# EAGLE design bias_v1 (EAGLE 9.6.2)
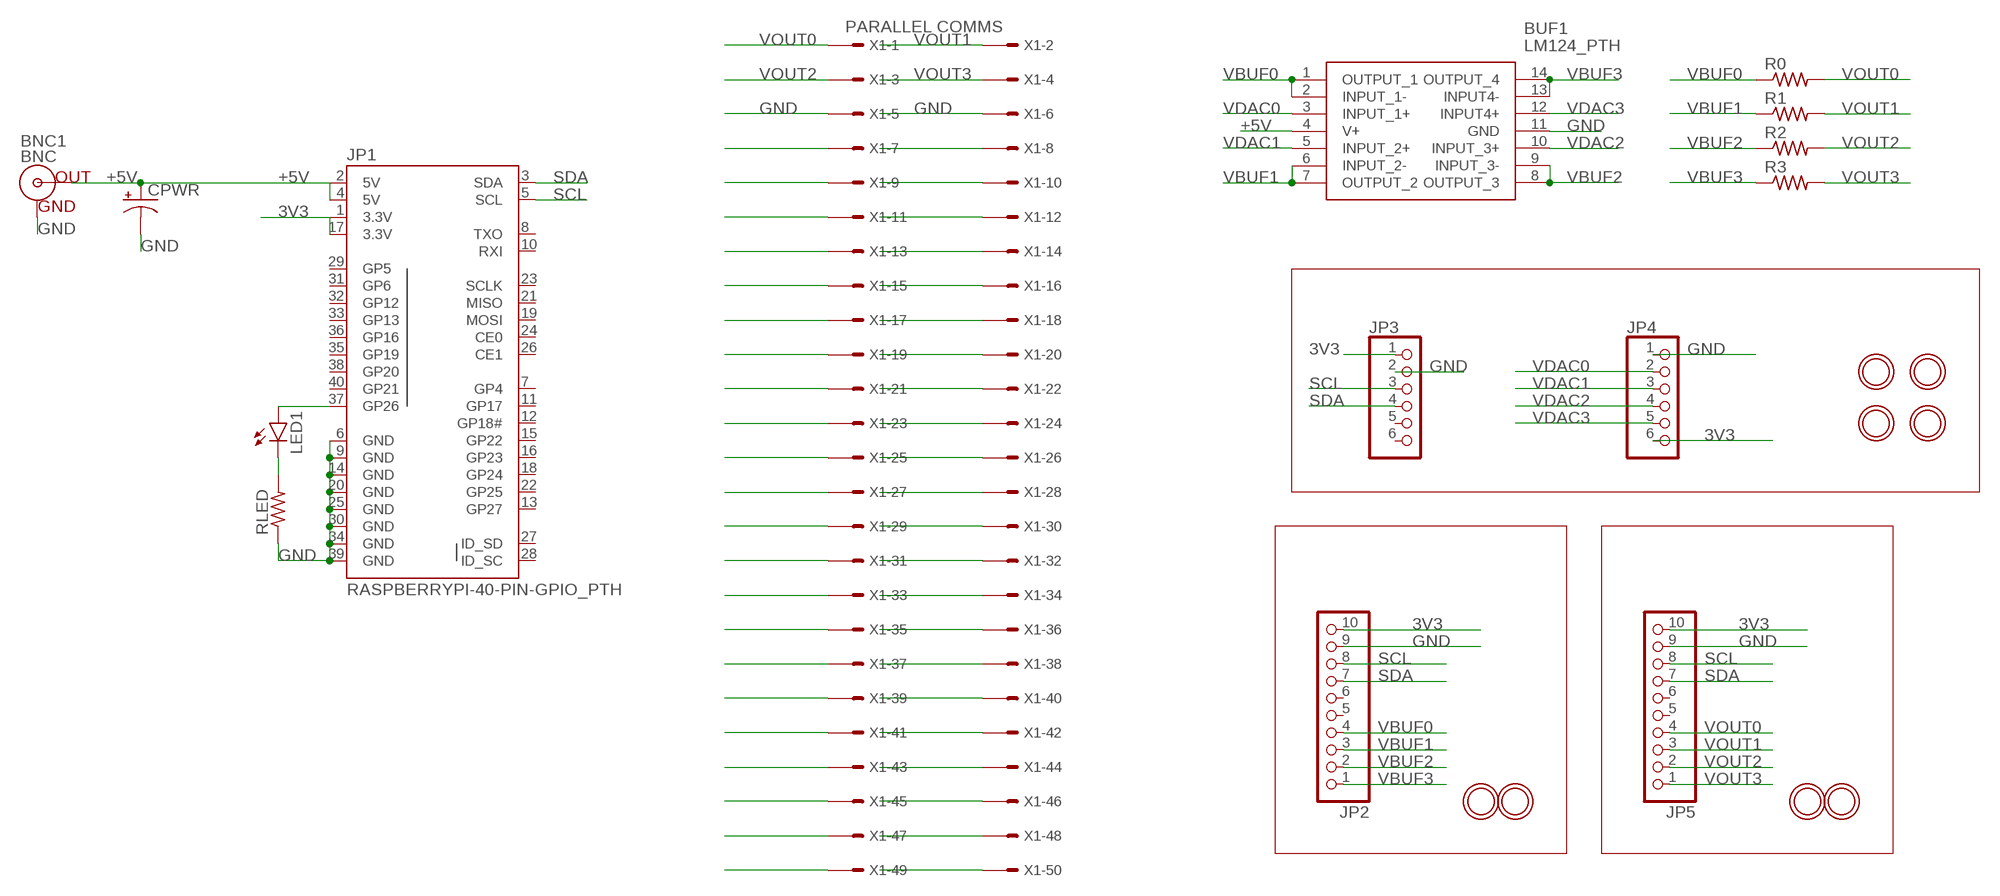
[diagram p0: schematic, sheet 1]

## Parts
BNC1  BNC  BNCPTH  [BNC]
BUF1  LM124_PTH  [CDIP790W66P254L1954H508Q14]
CPWR  CPOL-USE2.5-6  [E2,5-6]
JP1  RASPBERRYPI-40-PIN-GPIO_PTH  [2X20_SHROUDED]
JP2  HEADER-1X1070MIL  [1X10_ROUND70]
JP3  HEADER-1X670MIL  [1X06_ROUND_70]
JP4  HEADER-1X670MIL  [1X06_ROUND_70]
JP5  HEADER-1X1070MIL  [1X10_ROUND70]
LED1  LED3MM  [LED3MM]
R0  R-US_0204/7  [0204/7]
R1  R-US_0204/7  [0204/7]
R2  R-US_0204/7  [0204/7]
R3  R-US_0204/7  [0204/7]
RLED  R-US_0204/7  [0204/7]
U$3  MOUNTINGHOLE2.5  [MOUNTINGHOLE_2.5_PLATED]
U$4  MOUNTINGHOLE2.5  [MOUNTINGHOLE_2.5_PLATED]
U$5  MOUNTINGHOLE2.5  [MOUNTINGHOLE_2.5_PLATED]
U$6  MOUNTINGHOLE2.5  [MOUNTINGHOLE_2.5_PLATED]
U$7  MOUNTINGHOLE2.5  [MOUNTINGHOLE_2.5_PLATED]
U$8  MOUNTINGHOLE2.5  [MOUNTINGHOLE_2.5_PLATED]
U$15  MOUNTINGHOLE2.5  [MOUNTINGHOLE_2.5_PLATED]
U$16  MOUNTINGHOLE2.5  [MOUNTINGHOLE_2.5_PLATED]
X1  PARALLEL COMMS  057-050-1  [057-050-1]

## Nets
3V3: JP1.1(3.3V) JP1.17(3.3V) JP2.10 JP3.1 JP4.6 JP5.10
+5V: BNC1.S(OUT) BUF1.4(V+) CPWR.+ JP1.2(5V) JP1.4(5V)
GND: BNC1.GND BUF1.11(GND) CPWR.- JP1.6(GND) JP1.9(GND) JP1.14(GND) JP1.20(GND) JP1.25(GND) JP1.30(GND) JP1.34(GND) JP1.39(GND) JP2.9 JP3.2 JP4.1 JP5.9 RLED.1 X1.5 X1.6
N$1: JP1.37(GP26) LED1.A
N$2: LED1.K(C) RLED.2
N$4: X1.7
N$5: X1.9
N$6: X1.11
N$7: X1.13
N$8: X1.15
N$9: X1.17
N$10: X1.19
N$11: X1.21
N$12: X1.23
N$13: X1.25
N$14: X1.27
N$15: X1.29
N$16: X1.31
N$17: X1.33
N$18: X1.35
N$19: X1.37
N$20: X1.39
N$21: X1.41
N$22: X1.43
N$23: X1.45
N$24: X1.47
N$25: X1.49
N$26: X1.42
N$27: X1.44
N$28: X1.46
N$29: X1.48
N$30: X1.50
N$31: X1.32
N$32: X1.34
N$33: X1.36
N$34: X1.38
N$35: X1.40
N$36: X1.22
N$37: X1.24
N$38: X1.26
N$39: X1.28
N$40: X1.30
N$41: X1.12
N$42: X1.14
N$43: X1.16
N$44: X1.18
N$45: X1.20
N$49: X1.8
N$50: X1.10
SCL: JP1.5(SCL) JP2.8 JP3.3 JP5.8
SDA: JP1.3(SDA) JP2.7 JP3.4 JP5.7
VBUF0: BUF1.1(OUTPUT_1) BUF1.2(INPUT_1-) JP2.4 R0.1
VBUF1: BUF1.6(INPUT_2-) BUF1.7(OUTPUT_2) JP2.3 R1.1
VBUF2: BUF1.8(OUTPUT_3) BUF1.9(INPUT_3-) JP2.2 R2.1
VBUF3: BUF1.13(INPUT4-) BUF1.14(OUTPUT_4) JP2.1 R3.1
VDAC0: BUF1.3(INPUT_1+) JP4.2
VDAC1: BUF1.5(INPUT_2+) JP4.3
VDAC2: BUF1.10(INPUT_3+) JP4.4
VDAC3: BUF1.12(INPUT4+) JP4.5
VOUT0: JP5.4 R0.2 X1.1
VOUT1: JP5.3 R1.2 X1.2
VOUT2: JP5.2 R2.2 X1.3
VOUT3: JP5.1 R3.2 X1.4
Unconnected: JP1.7(GP4) JP1.8(TXO) JP1.10(RXI) JP1.11(GP17) JP1.12(GP18#) JP1.13(GP27) JP1.15(GP22) JP1.16(GP23) JP1.18(GP24) JP1.19(MOSI) JP1.21(MISO) JP1.22(GP25) JP1.23(SCLK) JP1.24(CE0) JP1.26(CE1) JP1.27(ID_SD) JP1.28(ID_SC) JP1.29(GP5) JP1.31(GP6) JP1.32(GP12) JP1.33(GP13) JP1.35(GP19) JP1.36(GP16) JP1.38(GP20) JP1.40(GP21) JP2.5 JP2.6 JP3.5 JP3.6 JP5.5 JP5.6

## Library data of the parts
BNC1 = SparkFun-Connectors:BNC: BNC Right Angle Connector Mouser Part# 5227161 SparkFun Products: BNC Connector - Right Angle <https://www.sparkfun.com/products/10550>; PROD_ID: LPA-12729; SF_ID: PRT-10550
BUF1 = SamacSys_Parts:LM124_PTH: Low Power Quad Operational Amplifier Source: Datasheet <http://www.ti.com/lit/gpn/lm124-n>; ARROW_PART_NUMBER: LM124J/PB; ARROW_PRICE-STOCK: https://www.arrow.com/en/products/lm124jpb/texas-instruments; DESCRIPTION: Low Power Quad Operational Amplifier; HEIGHT: 5.08mm; MANUFACTURER_NAME: Texas Instruments; MANUFACTURER_PART_NUMBER: LM124J/PB; MOUSER_PART_NUMBER: 926-LM124J; MOUSER_PRICE-STOCK: https://www.mouser.co.uk/ProductDetail/Texas-Instruments/LM124J-PB?qs=iiglMaU8SAcLiddS7jKHDA%3D%3D
CPWR = rcl:CPOL-US: POLARIZED CAPACITOR, American symbol; SPICEPREFIX: C
JP1 = SparkFun-Connectors:RASPBERRYPI-40-PIN-GPIO: Raspberry Pi GPIO Header 2x20 pin connector, as found on B, B+, A+ models. Both shrouded PTH and SMT versions available. SparkFun Products: GPIO Shrouded Header <https://www.sparkfun.com/products/13054>- PTH SparkFun Pi Wedge (Preassembled) <https://www.sparkfun.com/products/13717>; PROD_ID: CONN-12263; SF_ID: PRT-13054
JP2 JP5 = microbuilder:HEADER-1X10: PIN HEADER
JP3 JP4 = microbuilder:HEADER-1X6: PIN HEADER
LED1 = led:LED: LED OSRAM: - CHIPLED LG R971, LG N971, LY N971, LG Q971, LY Q971, LO R971, LY R971 LH N974, LH R974 LS Q976, LO Q976, LY Q976 LO Q996 - Hyper CHIPLED LW Q18S LB Q993, LB Q99A, LB R99A - SideLED LS A670, LO A670, LY A670, LG A670, LP A670 LB A673, LV A673, LT A673, LW A673 LH A674 LY A675 LS A676, LA A676, LO A676, LY A676, LW A676 LS A679, LY A679, LG A679 - Hyper Micro SIDELED® LS Y876, LA Y876, LO Y876, LY Y876 LT Y87S - SmartLED LW L88C, LW L88S LB L89C, LB L89S, LG L890 LS L89K, LO L89K, LY L89K LS L896, LA L896, LO L896, LY L896 - TOPLED LS T670, LO T670, LY T670, LG T670, LP T670 LSG T670, LSP T670, LSY T670, LOP T670, LYG T670 LG T671, LOG T671, LSG T671 LB T673, LV T673, LT T673, LW T673 LH T674 LS T676, LA T676, LO T676, LY T676, LB T676, LH T676, LSB T676, LW T676 LB T67C, LV T67C, LT T67C, LS T67K, LO T67K, LY T67K, LW E67C LS E67B, LA E67B, LO E67B, LY E67B, LB E67C, LV E67C, LT E67C LW T67C LS T679, LY T679, LG T679 LS T770, LO T770, LY T770, LG T770, LP T770 LB T773, LV T773, LT T773, LW T773 LH T774 LS E675, LA E675, LY E675, LS T675 LS T776, LA T776, LO T776, LY T776, LB T776 LHGB T686 LT T68C, LB T68C - Hyper Mini TOPLED® LB M676 - Mini TOPLED Santana® LG M470 LS M47K, LO M47K, LY M47K Source: http://www.osram.convergy.de LUXEON: - LUMILED® LXK2-PW12-R00, LXK2-PW12-S00, LXK2-PW14-U00, LXK2-PW14-V00 LXK2-PM12-R00, LXK2-PM12-S00, LXK2-PM14-U00 LXK2-PE12-Q00, LXK2-PE12-R00, LXK2-PE12-S00, LXK2-PE14-T00, LXK2-PE14-U00 LXK2-PB12-K00, LXK2-PB12-L00, LXK2-PB12-M00, LXK2-PB14-N00, LXK2-PB14-P00, LXK2-PB14-Q00 LXK2-PR12-L00, LXK2-PR12-M00, LXK2-PR14-Q00, LXK2-PR14-R00 LXK2-PD12-Q00, LXK2-PD12-R00, LXK2-PD12-S00 LXK2-PH12-R00, LXK2-PH12-S00 LXK2-PL12-P00, LXK2-PL12-Q00, LXK2-PL12-R00 Source: www.luxeon.com KINGBRIGHT: KA-3528ASYC Source: www.kingbright.com
R0 R1-R3 RLED = rcl:R-US_: RESISTOR, American symbol; SPICEPREFIX: R
U$3-U$8 U$15 U$16 = microbuilder:MOUNTINGHOLE: Mounting Hole For #2 screws (0.086"/2.18mm width, 0.094"/2.4mm hole) use 2.5mm
X1 = con-panduit:057-050-: CONNECTOR 50-pin series 057 contact pc board low profile headers; OC_FARNELL: unknown; OC_NEWARK: unknown

## Net classes
2 lowpower: width 0.305 mm, drill 0.483 mm

## Board
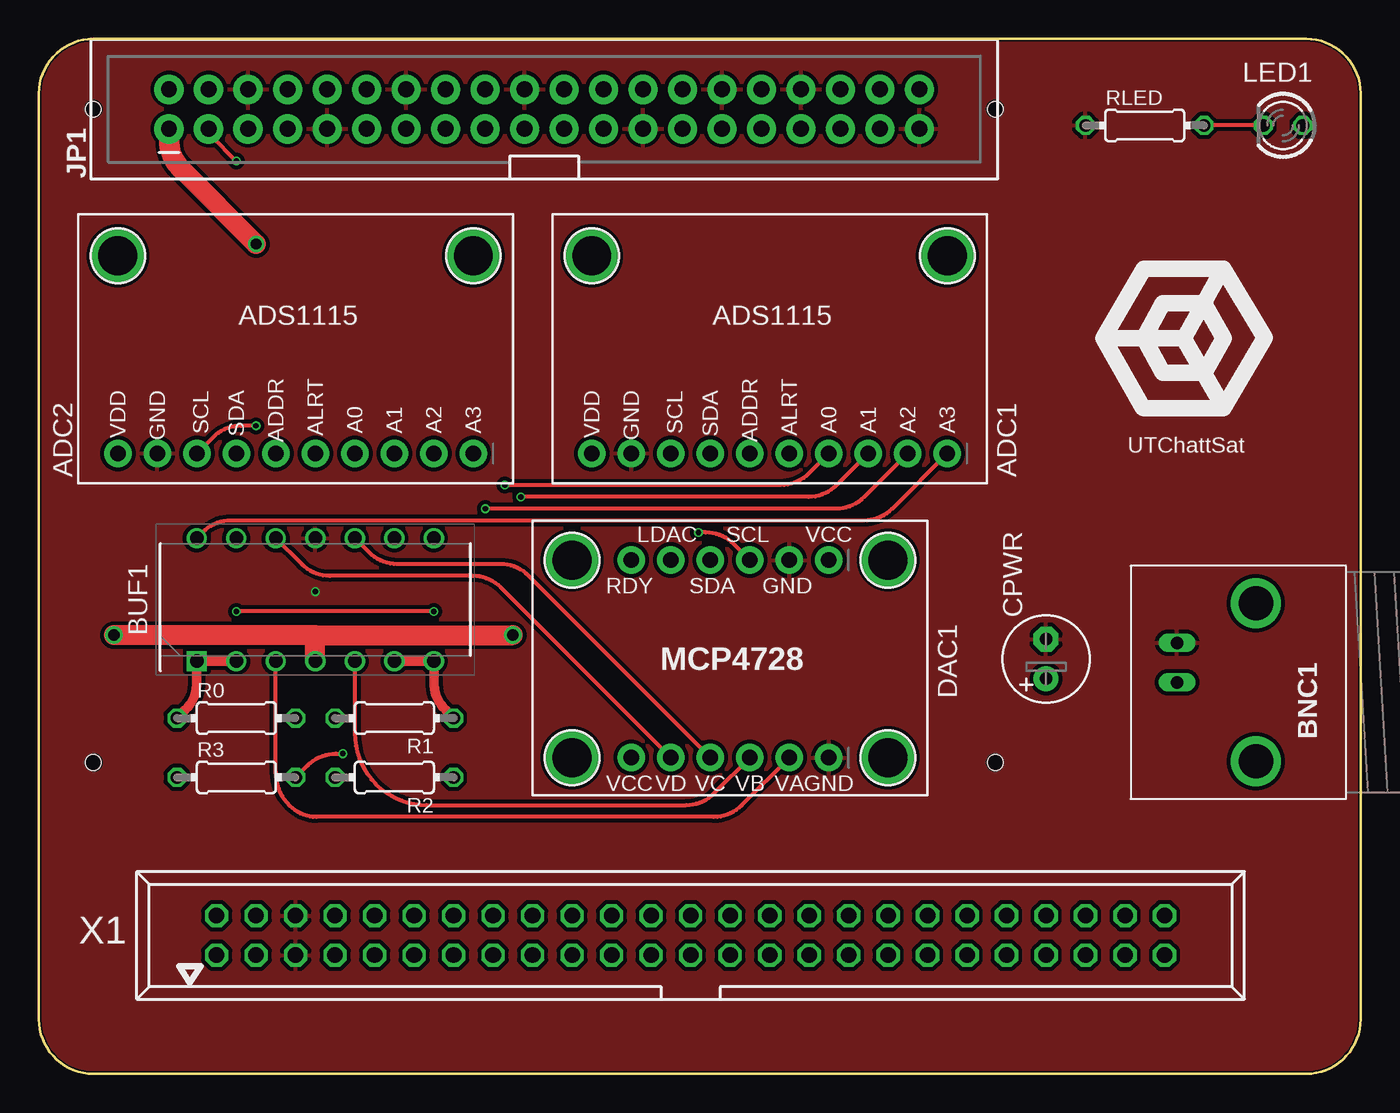
[diagram p1: board, top side]
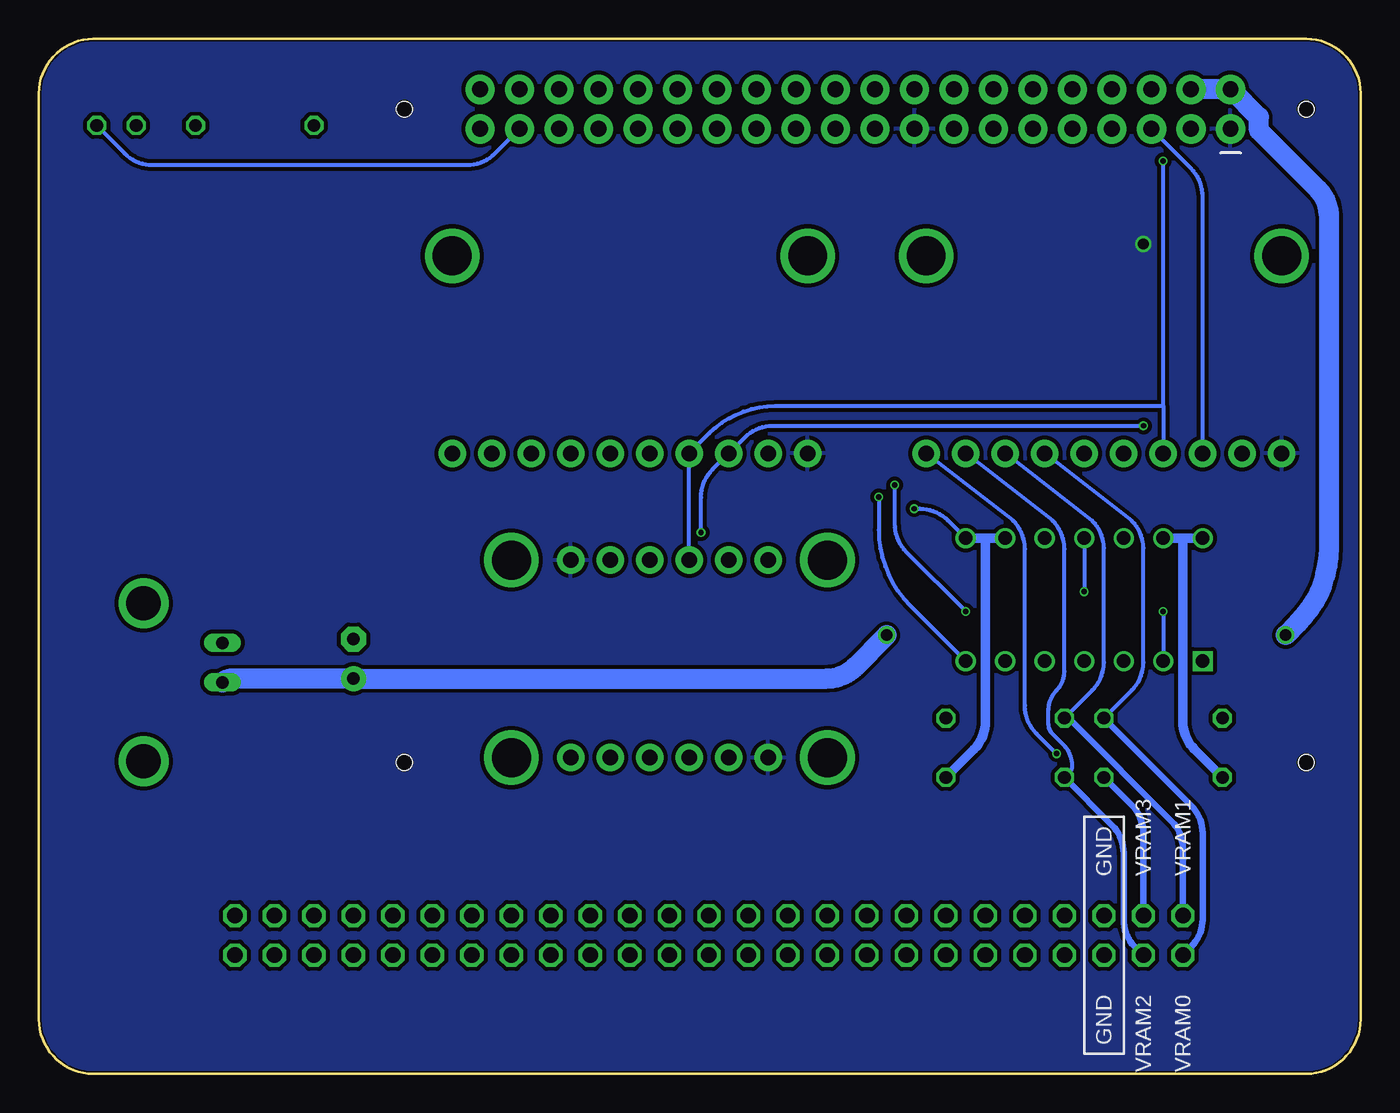
[diagram p2: board, bottom side, seen from below]

Size 85 x 66.53 mm. Coordinates in mm from the lower left corner, seen from the top.
Outline: 3.5,0 81.5,0 arc90 85,3.5 85,63.03 arc90 81.5,66.53 3.5,66.53 arc90 0,63.03 0,3.5 arc90 3.5,0
Copper layers (1*16): Top 0.035mm / dielectric 0.2mm / Bottom 0.035mm
Design rules "jlcpcb-2-layer *": minimum track width 10mil, minimum drill 0.2mm, track to track 10mil, track to pad 10mil, pad to pad 5mil, via to via 5mil, smd to smd 0mil, copper to edge 0.1mm, drill to drill 5mil, minimum pad ring 4mil, minimum via ring 4mil, stop-mask expansion 3mil, vias tented up to drill 100mil, thermal gap 10mil
Holes 1 mm at 3.5,62.01 61.5,62.01 61.5,20.01 3.5,20.01

### Footprints (pad centres in the part's own frame; a part is rotated, then mirrored left to right if it is on the bottom)
BNC = drill 2.2: 3 -5.08,5.08; 4 5.08,5.08 | drill 0.8 long: GND -2.54,0; S 0,0
CDIP790W66P254L1954H508Q14 = drill 0.86 pad 1.26 square: 1 -3.95,7.62 | drill 0.86 pad 1.26: 2 -3.95,5.08; 3 -3.95,2.54; 4 -3.95,0; 5 -3.95,-2.54; 6 -3.95,-5.08; 7 -3.95,-7.62; 8 3.95,-7.62; 9 3.95,-5.08; 10 3.95,-2.54; 11 3.95,0; 12 3.95,2.54; 13 3.95,5.08; 14 3.95,7.62
E2,5-6 = drill 0.813 pad 1.6: + -1.27,0 | drill 0.813 pad 1.6 octagon: - 1.27,0
2X20_SHROUDED = drill 1.016 pad 1.88: 1 -1.27,24.13; 2 1.27,24.13; 3 -1.27,21.59; 4 1.27,21.59; 5 -1.27,19.05; 6 1.27,19.05; 7 -1.27,16.51; 8 1.27,16.51; 9 -1.27,13.97; 10 1.27,13.97; 11 -1.27,11.43; 12 1.27,11.43; 13 -1.27,8.89; 14 1.27,8.89; 15 -1.27,6.35; 16 1.27,6.35; 17 -1.27,3.81; 18 1.27,3.81; 19 -1.27,1.27; 20 1.27,1.27; 21 -1.27,-1.27; 22 1.27,-1.27; 23 -1.27,-3.81; 24 1.27,-3.81; 25 -1.27,-6.35; 26 1.27,-6.35; 27 -1.27,-8.89; 28 1.27,-8.89; 29 -1.27,-11.43; 30 1.27,-11.43; 31 -1.27,-13.97; 32 1.27,-13.97; 33 -1.27,-16.51; 34 1.27,-16.51; 35 -1.27,-19.05; 36 1.27,-19.05; 37 -1.27,-21.59; 38 1.27,-21.59; 39 -1.27,-24.13; 40 1.27,-24.13
1X10_ROUND70 = drill 1 pad 1.778: 1 -11.43,0; 2 -8.89,0; 3 -6.35,0; 4 -3.81,0; 5 -1.27,0; 6 1.27,0; 7 3.81,0; 8 6.35,0; 9 8.89,0; 10 11.43,0
1X06_ROUND_70 = drill 1 pad 1.778: 1 -6.35,0; 2 -3.81,0; 3 -1.27,0; 4 1.27,0; 5 3.81,0; 6 6.35,0
LED3MM = drill 0.813 octagon: A -1.27,0; K 1.27,0
0204/7 = drill 0.813 octagon: 1 -3.81,0; 2 3.81,0
MOUNTINGHOLE_2.5_PLATED = drill 2.5 pad 3.2: P$1 0,0
057-050-1 = drill 1 octagon: 1 -30.48,-1.27; 2 -30.48,1.27; 3 -27.94,-1.27; 4 -27.94,1.27; 5 -25.4,-1.27; 6 -25.4,1.27; 7 -22.86,-1.27; 8 -22.86,1.27; 9 -20.32,-1.27; 10 -20.32,1.27; 11 -17.78,-1.27; 12 -17.78,1.27; 13 -15.24,-1.27; 14 -15.24,1.27; 15 -12.7,-1.27; 16 -12.7,1.27; 17 -10.16,-1.27; 18 -10.16,1.27; 19 -7.62,-1.27; 20 -7.62,1.27; 21 -5.08,-1.27; 22 -5.08,1.27; 23 -2.54,-1.27; 24 -2.54,1.27; 25 0,-1.27; 26 0,1.27; 27 2.54,-1.27; 28 2.54,1.27; 29 5.08,-1.27; 30 5.08,1.27; 31 7.62,-1.27; 32 7.62,1.27; 33 10.16,-1.27; 34 10.16,1.27; 35 12.7,-1.27; 36 12.7,1.27; 37 15.24,-1.27; 38 15.24,1.27; 39 17.78,-1.27; 40 17.78,1.27; 41 20.32,-1.27; 42 20.32,1.27; 43 22.86,-1.27; 44 22.86,1.27; 45 25.4,-1.27; 46 25.4,1.27; 47 27.94,-1.27; 48 27.94,1.27; 49 30.48,-1.27; 50 30.48,1.27

### Placement (x,y rotation side)
BNC1  73.19,25.16 270 top
BUF1  17.78,30.48 90 top
CPWR  64.77,26.67 90 top
JP1  32.5,62.01 90 top
JP2  46.99,39.88 180 top
JP3  44.45,33.02 180 top
JP4  44.45,20.32 180 top
JP5  16.51,39.88 180 top
LED1  80.01,60.96 180 top
R0  12.7,22.86 0 top
R1  22.86,22.86 180 top
R2  22.86,19.05 180 top
R3  12.7,19.05 0 top
RLED  71.12,60.96 0 top
U$3  58.42,52.58 180 top
U$4  54.61,20.32 180 top
U$5  34.29,20.32 180 top
U$6  54.61,33.02 180 top
U$7  34.29,33.02 180 top
U$8  35.56,52.58 180 top
U$15  27.94,52.58 180 top
U$16  5.08,52.58 180 top
X1  41.91,8.89 0 top

### Tracks (layer width: path | path; a pad name or v marks a point on that pad's centre or on a via)
3V3  (via drill 0.7)
  Top 1.27: JP1.1 8.37,59.99 arc45 9.11,58.2 v13.97,53.34
  pour Bottom: -0.25,67.06 -0.25,-0.25 85.34,-0.25 85.34,67.06
+5V  (via drill 0.75)
  Top 1.27: BUF1.4 17.78,28.19 | 17.78,28.19 v30.48,28.19 | 17.78,28.19 v4.83,28.19
  Bottom 1.27: BNC1.S arc45 72.61,25.4 CPWR.+ 34.33,25.4 arc-45 32.53,26.14 v30.48,28.19 | v4.83,28.19 4.03,28.99 arc-45 2.03,33.82 2.03,55.12 arc-45 2.75,56.85 6.54,60.64 6.54,61.5 8.32,63.28 JP1.2 JP1.4
GND  (via drill 0.35)
  Bottom 0.254: BUF1.11 v17.78,30.99
  pour Top: -0.25,67.06 85.34,67.06 85.34,66.8 85.34,-0.25 -0.25,-0.25
N$1
  Bottom 0.254: LED1.A 79.48,59.16 arc-45 77.69,58.42 57.46,58.42 arc-45 55.67,59.16 JP1.37
N$2
  Top 0.254: LED1.K RLED.2
SCL  (via drill 0.35)
  Top 0.254: JP3.3 44.69,34.05 arc45 42.89,34.8 v42.42,34.8 | v13.97,41.66 12.99,41.66 arc45 11.19,40.91 JP5.8
  Bottom 0.254: JP5.8 10.16,56.4 arc-45 10.9,58.19 JP1.5 | v13.97,41.66 37.81,41.66 arc-45 39.61,40.91 JP2.8 41.67,38.84 arc-45 42.42,37.05 v42.42,34.8
SDA  (via drill 0.35)
  Top 0.254: v12.7,58.67 11.11,60.27 arc-45 JP1.3
  Bottom 0.254: JP3.4 JP2.7 41.9,41.16 arc45 37.64,42.93 12.7,42.93 | 12.7,42.93 JP5.7 | 12.7,42.93 v12.7,58.67
VBUF0  (via drill 0.35)
  Top 0.254: JP2.4 49.51,38.59 arc-45 47.72,37.85 v29.97,37.85 | v25.4,29.72 v12.7,29.72
  Top 0.61: BUF1.2 BUF1.1 10.16,25.18 arc-45 9.42,23.39 R0.1
  Bottom 0.254: v29.97,37.85 29.97,35.34 arc-45 29.23,33.55 v25.4,29.72 | v12.7,29.72 BUF1.2
VBUF1  (via drill 0.35)
  Top 0.254: JP2.3 51.29,37.83 arc-45 49.49,37.08 v30.99,37.08
  Top 0.61: BUF1.6 BUF1.7 25.4,25.18 arc45 26.14,23.39 R1.1
  Bottom 0.254: v30.99,37.08 30.99,34.97 arc-45 28.97,30.1 BUF1.7
VBUF2  (via drill 0.35)
  Top 0.254: JP2.2 53.07,37.07 arc-45 51.27,36.32 v28.7,36.32
  Bottom 0.254: v28.7,36.32 28.34,36.32 arc45 26.55,35.58 BUF1.8
  Bottom 0.61: BUF1.9 24.13,34.43 | 24.13,34.43 BUF1.8 | R2.1 24.87,20.85 arc-45 24.13,22.64 24.13,34.43
VBUF3
  Top 0.254: JP2.1 54.85,36.3 arc-45 53.05,35.56 12.34,35.56 arc45 10.55,34.82 BUF1.14
  Bottom 0.61: BUF1.14 11.43,34.43 | 11.43,34.43 BUF1.13 | R3.1 10.69,20.85 arc45 11.43,22.64 11.43,34.43
VDAC0
  Top 0.254: JP4.2 45.19,17.25 arc-45 43.4,16.51 17.84,16.51 arc-45 16.15,17.21 arc-45 15.24,19.41 BUF1.3
VDAC1
  Top 0.254: JP4.3 43.42,18.02 arc-45 41.62,17.27 24.93,17.27 arc-45 21.67,18.62 arc-45 20.32,21.88 BUF1.5
VDAC2
  Top 0.254: JP4.4 31.48,32.02 arc45 29.68,32.77 23.04,32.77 arc-45 21.24,33.51 BUF1.10
VDAC3
  Top 0.254: JP4.5 29.7,31.26 arc45 27.9,32 18.72,32 arc-45 16.92,32.75 BUF1.12
VOUT0
  Bottom 0.254: R0.2 14.71,24.66 arc-45 13.97,26.45 13.97,33.78 arc-45 14.69,35.52 JP5.4
  Bottom 0.406: R0.2 10.9,17.25 arc45 10.16,15.46 10.16,9.94 arc45 10.9,8.15 X1.1
VOUT1
  Bottom 0.254: R1.2 17.25,24.66 arc-45 16.51,26.45 16.51,33.78 arc-45 17.23,35.52 17.27,35.56 JP5.3
  Bottom 0.406: X1.2 11.43,14.44 arc-45 12.17,16.24 18.62,22.68 arc-45 R1.2
VOUT2
  Bottom 0.254: R2.2 18.72,19.38 arc-45 18.54,19.81 arc-45 19.08,21.11 19.81,21.84 arc45 20.07,22.46 20.07,23.41 arc45 19.56,24.64 arc-45 19.05,25.86 19.05,33.75 arc-45 19.79,35.54 JP5.2
  Bottom 0.406: R2.2 15.98,15.98 arc45 15.24,14.19 15.24,9.91 arc-45 14.52,8.17 X1.3
VOUT3  (via drill 0.35)
  Top 0.254: R3.2 17.29,19.83 arc-45 19.09,20.57 v19.56,20.57
  Bottom 0.254: v19.56,20.57 20.85,21.86 arc45 21.59,23.66 21.59,33.75 arc-45 22.33,35.54 JP5.1
  Bottom 0.406: R3.2 14.71,17.25 arc45 13.97,15.46 X1.4

### Text on the board
tPlace: ADS1115 | ADS1115 | ADDR | ALRT | ADDR | ALRT | VDD | GND | SCL | SDA | VDD | GND | SCL | SDA | A0 | A1 | A2 | A3 | A0 | A1 | A2 | A3 | ADC2 | ADC1 | LDAC | SCL | VCC | RDY | SDA | GND | MCP4728 | DAC1 | VCC | VD | VC | VB | VA | GND
bPlace: VRAM1 | VRAM3 | GND | VRAM0 | VRAM2 | GND
tNames: UTChattSat